# Altium schematic sheet 04_SIM.SchDoc
size A4
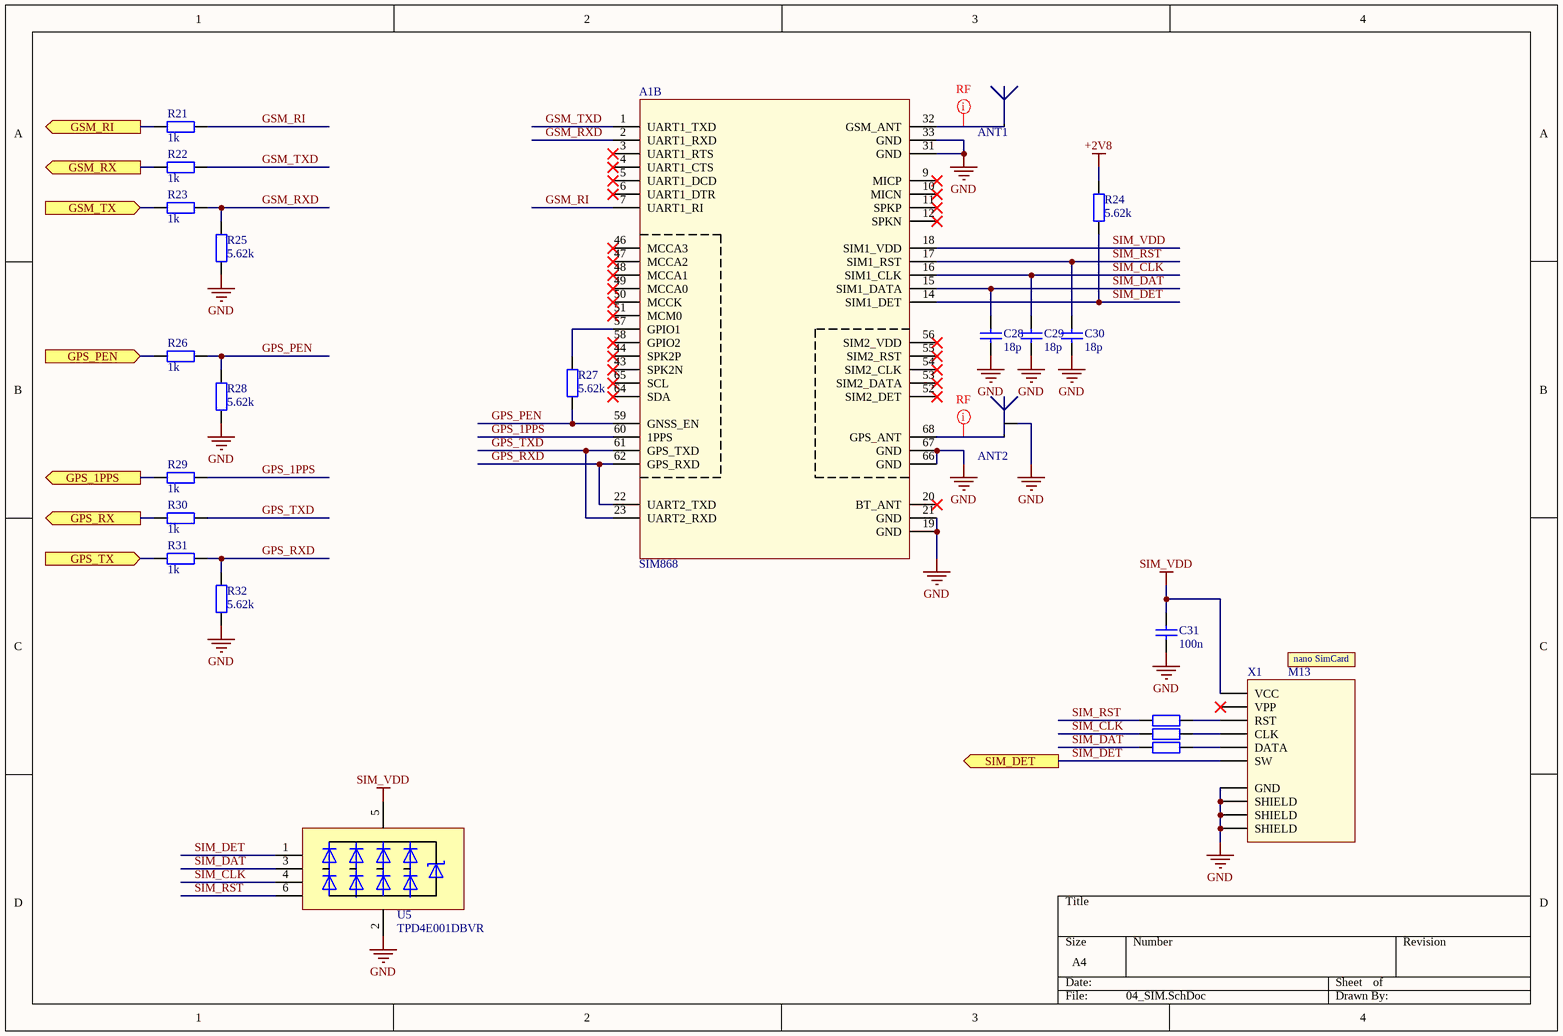
[diagram p0: 04_SIM.SchDoc]

## Parts
A1  SIM868  [SIM868]  (part B of 2)
ANT1  W3070  [W3070]  (value not drawn)
ANT2  ANT3216LL15R1575A  [ANT3216LL15]  (value not drawn)
C28  18p  [C0603_IPC_MD]
C29  18p  [C0603_IPC_MD]
C30  18p  [C0603_IPC_MD]
C31  100n  [C0603_IPC_MD]
M13  SIMCARD-NANO  (value not drawn)  (mechanical)
R21  1k  [R0603_IPC_MD]
R22  1k  [R0603_IPC_MD]
R23  1k  [R0603_IPC_MD]
R24  5.62k  [R0603_IPC_MD]
R25  5.62k  [R0603_IPC_MD]
R26  1k  [R0603_IPC_MD]
R27  5.62k  [R0603_IPC_MD]
R28  5.62k  [R0603_IPC_MD]
R29  1k  [R0603_IPC_MD]
R30  1k  [R0603_IPC_MD]
R31  1k  [R0603_IPC_MD]
R32  5.62k  [R0603_IPC_MD]
R33  22R  [R0603_IPC_MD]  (value not drawn)
R34  22R  [R0603_IPC_MD]  (value not drawn)
R35  22R  [R0603_IPC_MD]  (value not drawn)
U5  TPD4E001DBVR  [SOT23-6]
X1  SNO-1305-B  [SNO-1305-B]  (value not drawn)

## Ports
GPS_1PPS (out), GPS_PEN (in), GPS_RX (out), GPS_TX (in), GSM_RI (out), GSM_RX (out), GSM_TX (in), SIM_DET (out)

## Nets
+2V8: R24.2
GND: A1.19(GND) A1.21(GND) A1.31(GND) A1.33(GND) A1.66(GND) A1.67(GND) ANT2.2 C28.1 C29.1 C30.1 C31.1 R25.1 R28.1 R32.1 U5.2(GND) X1.C5(GND) X1.S1(SHIELD) X1.S2(SHIELD) X1.S3(SHIELD)
SIM_VDD: A1.18(SIM1_VDD) C31.2 U5.5(VCC) X1.C1(VCC)
GPS_1PPS: A1.60(1PPS) R29.2
GPS_1PPS: R29.1 ; port GPS_1PPS  [a separate net that carries the same name]
GPS_PEN: A1.59(GNSS_EN) R26.2 R27.1 R28.2
GPS_PEN: R26.1 ; port GPS_PEN  [a separate net that carries the same name]
GPS_RX: R30.1 ; port GPS_RX
GPS_RXD: A1.22(UART2_TXD) A1.62(GPS_RXD) R31.2 R32.2
GPS_TX: R31.1 ; port GPS_TX
GPS_TXD: A1.23(UART2_RXD) A1.61(GPS_TXD) R30.2
GSM_RI: A1.7(UART1_RI) R21.2
GSM_RI: R21.1 ; port GSM_RI  [a separate net that carries the same name]
GSM_RX: R22.1 ; port GSM_RX
GSM_RXD: A1.2(UART1_RXD) R23.2 R25.2
GSM_TX: R23.1 ; port GSM_TX
GSM_TXD: A1.1(UART1_TXD) R22.2
SIM_CLK: A1.16(SIM1_CLK) C29.2 R34.1 U5.4(IO3)
SIM_DAT: A1.15(SIM1_DATA) C28.2 R35.1 U5.3(IO2)
SIM_DET: A1.14(SIM1_DET) R24.1 U5.1(IO1) X1.SW ; port SIM_DET
SIM_RST: A1.17(SIM1_RST) C30.2 R33.1 U5.6(IO4)
NetA1_32: A1.32(GSM_ANT) ANT1.1
NetA1_57: A1.57(GPIO1) R27.2
NetA1_68: A1.68(GPS_ANT) ANT2.1
NetR33_2: R33.2 X1.C2(RST)
NetR34_2: R34.2 X1.C3(CLK)
NetR35_2: R35.2 X1.C7(DATA)

Not connected (* = marked no-connect by the designer): A1 3(UART1_RTS)* 4(UART1_CTS)* 5(UART1_DCD)* 6(UART1_DTR)* 9(MICP)* 10(MICN)* 11(SPKP)* 12(SPKN)* 20(BT_ANT)* 43(SPK2N)* 44(SPK2P)* 46(MCCA3)* 47(MCCA2)* 48(MCCA1)* 49(MCCA0)* 50(MCCK)* 51(MCM0)* 52(SIM2_DET)* 53(SIM2_DATA)* 54(SIM2_CLK)* 55(SIM2_RST)* 56(SIM2_VDD)* 58(GPIO2)* 64(SDA)* 65(SCL)*; X1 C6(VPP)*

## Layout directives
net class RF50: NetA1_32, NetA1_68

## Notes on the sheet
- (in symbol SIMCARD-NANO) nano SimCard

## Library data of the parts
A1 = SIM868: GSM & GPRS & GPS Modules PCBModule RoHS; Manufacturer: SIMCom Wireless Solutions; Manufacturer Part Number: SIM868; Supplier 1: LCSC; Supplier Part Number 1: C89549
ANT1 = W3070: RF ANT 900MHZ/1.8GHZ CHIP SLD; Manufacturer: PulseLarsen Antennas; Manufacturer Part Number: W3070; Supplier 1: Digi-Key; Supplier Part Number 1: 553-1695-1-ND
ANT2 = ANT3216LL15R1575A: RF ANT 1.575GHZ CHIP SOLDER SMD; Manufacturer: Yageo; Manufacturer Part Number: ANT3216LL15R1575A; Supplier 1: Digi-Key; Supplier Part Number 1: 311-1543-1-ND
C28-C30 = CL10C180JB8NNNC: CAP CER 18PF 50V C0G/NP0 0603; Manufacturer: Samsung Electro-Mechanics; Manufacturer Part Number: CL10C180JB8NNNC; Voltage: 50V; Value: 18p; Dielectric: C0G/NP0; Supplier 1: Digi-Key; Supplier Part Number 1: 1276-1089-1-ND
C31 = CL10B104KO8NNNC: CAP CER 0.1UF 16V X7R 0603; Manufacturer: Samsung Electro-Mechanics; Manufacturer Part Number: CL10B104KO8NNNC; Voltage: 16V; Value: 100n; Dielectric: X7R; Supplier 1: Digi-Key; Supplier Part Number 1: 1276-1005-1-ND
M13 = SIMCARD-NANO: Nano SimCard; Manufacturer: Beeline; Manufacturer Part Number: SIMCARD-NANO; Supplier 1: Beeline; Supplier Part Number 1: SIMCARD-NANO
R21-R23 R26 R29-R31 = CR0603-JW-102ELF: RES SMD 1K OHM 5% 1/10W 0603; Manufacturer: Bourns Inc.; Value: 1k; Tolarance: 5%; Manufacturer Part Number: CR0603-JW-102ELF; Supplier 1: Digi-Key; Supplier Part Number 1: CR0603-JW-102ELFCT-ND
R24 R25 R27 R28 R32 = CR0603-JW-5.62kR: RES 5.62K OHM 1% 1/10W 0603; Manufacturer: Stackpole Electronics Inc; Manufacturer Part Number: RMCF0603FT5K62; Value: 5.62k; Tolarance: ±1%; Supplier 1: Digi-Key; Supplier Part Number 1: RMCF0603FT5K62CT-ND
R33-R35 = CR0603-JW-220ELF: RES SMD 22 OHM 5% 1/10W 0603; Manufacturer: Bourns Inc.; Value: 22R; Tolarance: 5%; Manufacturer Part Number: CR0603-JW-220ELF; Supplier 1: Digi-Key; Supplier Part Number 1: CR0603-JW-220ELFCT-ND
U5 = TPD4E001DBVR: 4x TVS DIODE 5.5V SOT23-6; Manufacturer: TI; Manufacturer Part Number: TPD4E001DBVR; Supplier 1: Digi-Key; Supplier Part Number 1: 296-28203-1-ND
X1 = SNO-1305-B: Hinged Sim Card Connector. With 6 contacts, with switch for card detection. Profile above PCB is 1.43mm.; Manufacturer: SOFNG; Manufacturer Part Number: SNO-1305-B; Supplier 1: LCSC; Supplier Part Number 1: C111371